# Altium schematic sheet 05_nRF52840_Debug_and_Trace.SchDoc
size 420 x 297 mm; Author: Shpakov Dmitry; Address1: Address1; Address2: Address2; Address3: Address3; Address4: Address4; DocumentNumber: АБВГ.123456.001 Э3; SheetNumber: 6; SheetTotal: 13; Scale: 1:1; DocumentType: Схема электрическая принципиальная; FirstReferrence: АБВГ.123456.001
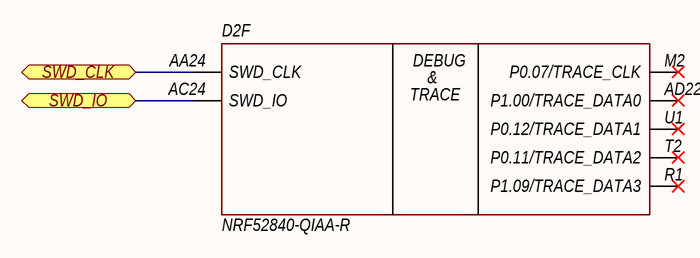
[diagram p0: 05_nRF52840_Debug_and_Trace.SchDoc]

## Parts
D2  NRF52840-QIAA-R  [AQFN50P700X700X85_HS-74N]  (part F of 9)

## Ports
SWD_CLK, SWD_IO

## Nets
SWD_CLK: D2.AA24(SWD_CLK) ; port SWD_CLK
SWD_IO: D2.AC24(SWD_IO) ; port SWD_IO

Not connected (* = marked no-connect by the designer): D2 AD22(P1.00/TRACE_DATA0)* M2(P0.07/TRACE_CLK)* R1(P1.09/TRACE_DATA3)* T2(P0.11/TRACE_DATA2)* U1(P0.12/TRACE_DATA1)*

## Notes on the sheet
- Author
- Manufacturer
- Date
- Page
- Total pages
- Size page
- A3
- Materials
- (in symbol nRF52840-QFN373, part F) DEBUG; &; TRACE

## Library data of the parts
D2 = nRF52840-QFN373: IC RF TxRx + MCU 802.15.4, Bluetooth Bluetooth v5.0 2.4GHz 73-VFQFN Dual Rows, Exposed Pad; Manufacturer: Nordic Semiconductor ASA; Power/Voltage: 1.7V ~ 5.5V; Operation Temperature: -40...+85; Help URL: https://www.digikey.com/en/products/detail/nexperia-usa-inc/2N7002-215/762973; Type: IC RF TXRX+MCU 802.15.4; Value: *; Tolerance: *; Note: *; Case: 73-aQFN (7x7); PartNumber: NRF52840-QIAA-R